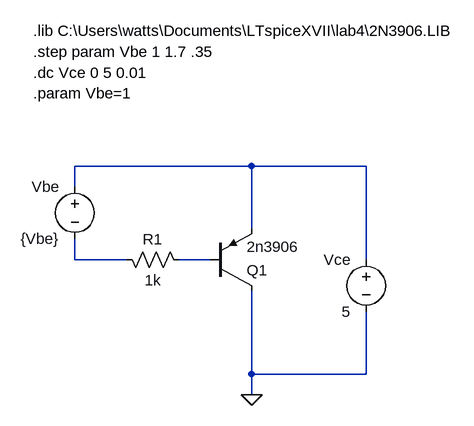
[diagram p0: schematic pnp_2n3906.asc]
pnp_2n3906.asc, the LTspice schematic file:
Version 4
SHEET 1 880 680
WIRE 160 16 -112 16
WIRE 336 16 160 16
WIRE -112 48 -112 16
WIRE 160 112 160 16
WIRE -112 160 -112 128
WIRE -32 160 -112 160
WIRE 96 160 48 160
WIRE 336 160 336 16
WIRE 160 336 160 208
WIRE 336 336 336 240
WIRE 336 336 160 336
WIRE 160 368 160 336
FLAG 160 368 0
SYMBOL voltage 336 144 M0
SYMATTR InstName Vce
SYMATTR Value 5
SYMBOL res 64 176 M270
WINDOW 0 32 56 VTop 2
WINDOW 3 0 56 VBottom 2
SYMATTR InstName R1
SYMATTR Value 1k
SYMBOL voltage -112 32 M0
SYMATTR InstName Vbe
SYMATTR Value {Vbe}
SYMBOL pnp 96 208 M180
SYMATTR InstName Q1
SYMATTR Value 2n3906
TEXT -176 -160 Left 2 !.step param Vbe 1 1.7 .35
TEXT -176 -128 Left 2 !.dc Vce 0 5 0.01
TEXT -176 -96 Left 2 !.param Vbe=1
TEXT -176 -192 Left 2 !.lib C:\\Users\\watts\\Documents\\LTspiceXVII\\lab4\\2N3906.LIB

The netlist it stands for:
* pnp_2n3906.asc
Vce N001 0 5
R1 N003 N002 1k
Vbe N001 N002 {Vbe}
Q1 0 N003 N001 0 2n3906
.model NPN NPN
.model PNP PNP
.lib standard.bjt
.step param Vbe 1 1.7 .35
.dc Vce 0 5 0.01
.param Vbe=1
.lib C:\Users\watts\Documents\LTspiceXVII\lab4\2N3906.LIB
.backanno
.end